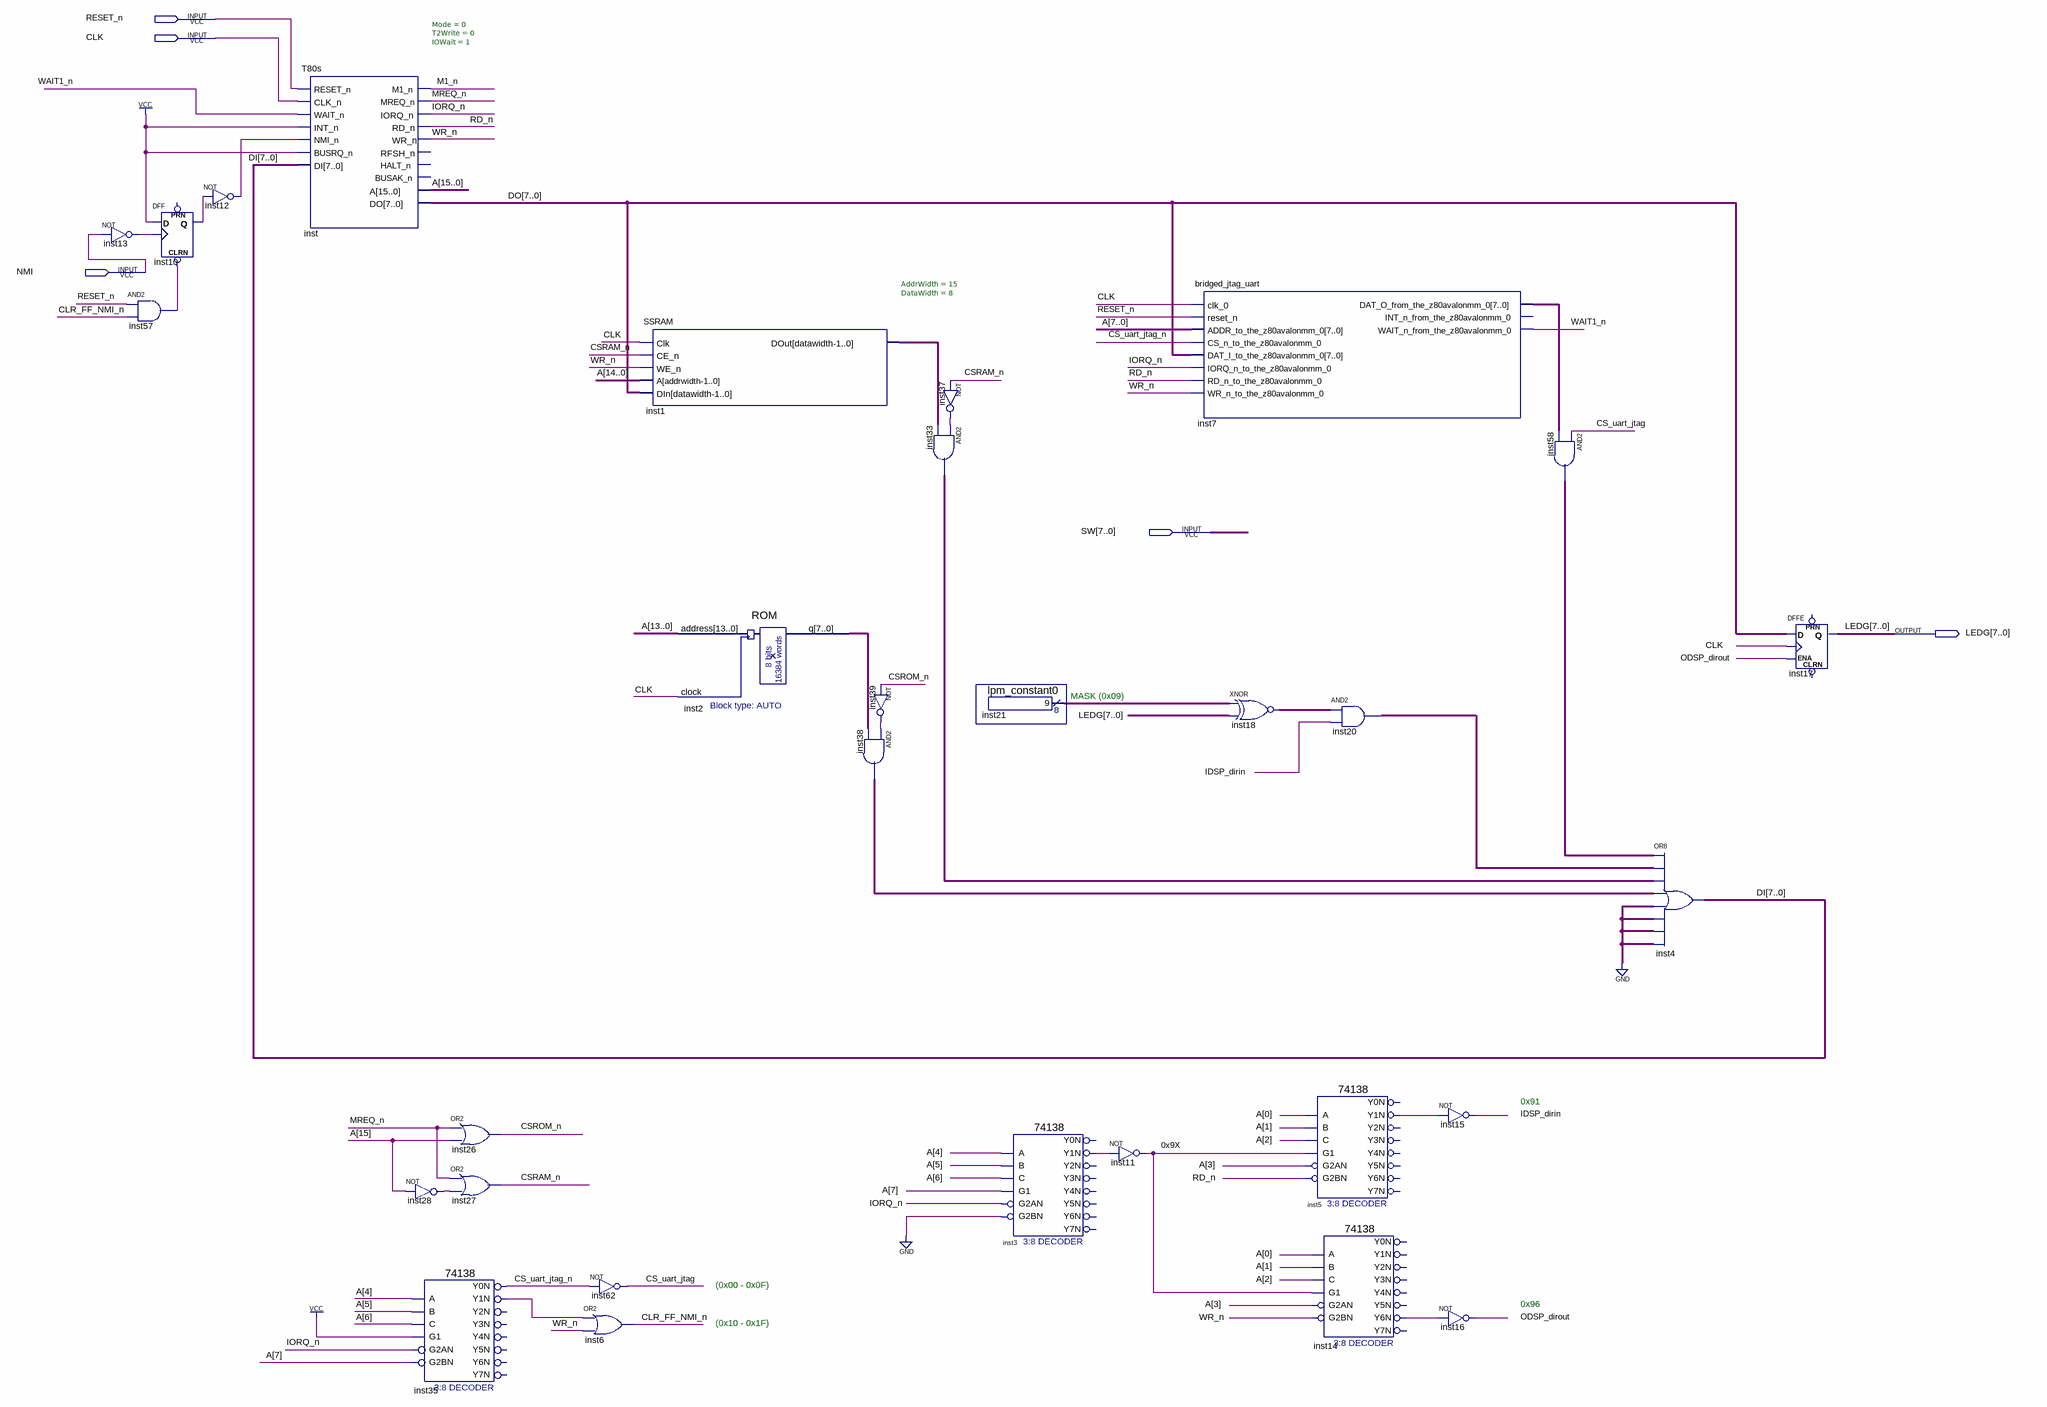
[diagram p0: schematic sheet]
// Quartus schematic sistema.bdf as structural Verilog: 30 symbols, 5 pins
module sistema (
  input  RESET_n,
  input  CLK,
  input  NMI,
  input  [7:0] SW,
  output [7:0] LEDG
);

  wire \0x9X , CLR_FF_NMI_n, CS_uart_jtag, CS_uart_jtag_n, CSRAM_n, CSROM_n, IDSP_dirin, inst3_y1n,
       inst5_y1n, inst10_q, inst12_out, inst13_out, inst14_y6n, inst28_out, inst35_y1n, inst37_out,
       inst39_out, inst57_out, IORQ_n, M1_n, MREQ_n, ODSP_dirout, RD_n, WAIT1_n, WR_n;
  wire [7:0] DI, DO, inst1_dout, inst2_q, inst7_dat_o_from_the_z80avalonmm_0, inst18_out, inst20_out,
       inst21_result, inst33_out, inst38_out, inst58_out;
  wire [15:0] A;

  not inst13 (inst13_out, NMI);
  DFF inst10 (.CLRN(inst57_out), .CLK(inst13_out), .D(1'b1), .Q(inst10_q));  // open: PRN
  and inst57 (inst57_out, RESET_n, CLR_FF_NMI_n);
  not inst12 (inst12_out, inst10_q);
  T80s #(.Mode(0), .T2Write(0), .IOWait(1)) inst (
    .RESET_n(RESET_n), .CLK_n(CLK), .WAIT_n(WAIT1_n), .INT_n(1'b1), .NMI_n(inst12_out), .BUSRQ_n(1'b1),
    .DI(DI), .M1_n(M1_n), .MREQ_n(MREQ_n), .IORQ_n(IORQ_n), .RD_n(RD_n), .WR_n(WR_n), .A(A), .DO(DO));  // open: RFSH_n, HALT_n, BUSAK_n
  not inst28 (inst28_out, A[15]);
  or inst26 (CSROM_n, MREQ_n, A[15]);
  or inst27 (CSRAM_n, MREQ_n, inst28_out);
  \74138  inst35 (
    .A(A[4]), .B(A[5]), .G1(1'b1), .C(A[6]), .G2AN(IORQ_n), .G2BN(A[7]), .Y0N(CS_uart_jtag_n),
    .Y1N(inst35_y1n));  // open: Y2N, Y3N, Y4N, Y5N, Y6N, Y7N
  not inst62 (CS_uart_jtag, CS_uart_jtag_n);
  or inst6 (CLR_FF_NMI_n, inst35_y1n, WR_n);
  SSRAM #(.AddrWidth(15), .DataWidth(8)) inst1 (
    .Clk(CLK), .CE_n(CSRAM_n), .WE_n(WR_n), .A(A[14:0]), .DIn(DO), .DOut(inst1_dout));
  ROM inst2 (.address(A[13:0]), .clock(CLK), .q(inst2_q));
  assign inst38_out = {8{inst39_out}} & inst2_q;  // AND2 inst38, 8 bits wide
  not inst39 (inst39_out, CSROM_n);
  not inst37 (inst37_out, CSRAM_n);
  assign inst33_out = {8{inst37_out}} & inst1_dout;  // AND2 inst33, 8 bits wide
  lpm_constant0 inst21 (.result(inst21_result));
  \74138  inst3 (
    .A(A[4]), .B(A[5]), .G1(A[7]), .C(A[6]), .G2AN(IORQ_n), .G2BN(1'b0), .Y1N(inst3_y1n));  // open: Y0N, Y2N, Y3N, Y4N, Y5N, Y6N, Y7N
  not inst11 (\0x9X , inst3_y1n);
  bridged_jtag_uart inst7 (
    .clk_0(CLK), .reset_n(RESET_n), .ADDR_to_the_z80avalonmm_0(A[7:0]),
    .CS_n_to_the_z80avalonmm_0(CS_uart_jtag_n), .DAT_I_to_the_z80avalonmm_0(DO),
    .IORQ_n_to_the_z80avalonmm_0(IORQ_n), .RD_n_to_the_z80avalonmm_0(RD_n), .WR_n_to_the_z80avalonmm_0(WR_n),
    .DAT_O_from_the_z80avalonmm_0(inst7_dat_o_from_the_z80avalonmm_0), .WAIT_n_from_the_z80avalonmm_0(WAIT1_n));  // open: INT_n_from_the_z80avalonmm_0
  assign inst18_out = ~(inst21_result ^ LEDG);  // XNOR inst18, 8 bits wide
  \74138  inst5 (
    .A(A[0]), .B(A[1]), .G1(\0x9X ), .C(A[2]), .G2AN(A[3]), .G2BN(RD_n), .Y1N(inst5_y1n));  // open: Y0N, Y2N, Y3N, Y4N, Y5N, Y6N, Y7N
  \74138  inst14 (
    .A(A[0]), .B(A[1]), .G1(\0x9X ), .C(A[2]), .G2AN(A[3]), .G2BN(WR_n), .Y6N(inst14_y6n));  // open: Y0N, Y1N, Y2N, Y3N, Y4N, Y5N, Y7N
  assign inst20_out = inst18_out & {8{IDSP_dirin}};  // AND2 inst20, 8 bits wide
  not inst15 (IDSP_dirin, inst5_y1n);
  not inst16 (ODSP_dirout, inst14_y6n);
  assign inst58_out = {8{CS_uart_jtag}} & inst7_dat_o_from_the_z80avalonmm_0;  // AND2 inst58, 8 bits wide
  assign DI = inst58_out | inst20_out | inst33_out | inst38_out | {8{1'b0}} | {8{1'b0}} | {8{1'b0}} | {8{1'b0}};  // OR8 inst4, 8 bits wide
  DFFE inst17[7:0] (.D(DO), .CLK(CLK), .ENA(ODSP_dirout), .Q(LEDG));  // open: PRN, CLRN

  // Notes on the sheet:
  //   MASK (0x09)
  //   0x91
  //   (0x00 - 0x0F)
  //   0x96
  //   (0x10 - 0x1F)
endmodule
